# EAGLE schematic rl_energy_board (EAGLE 9.6.2)

## Sheet 1 of 4
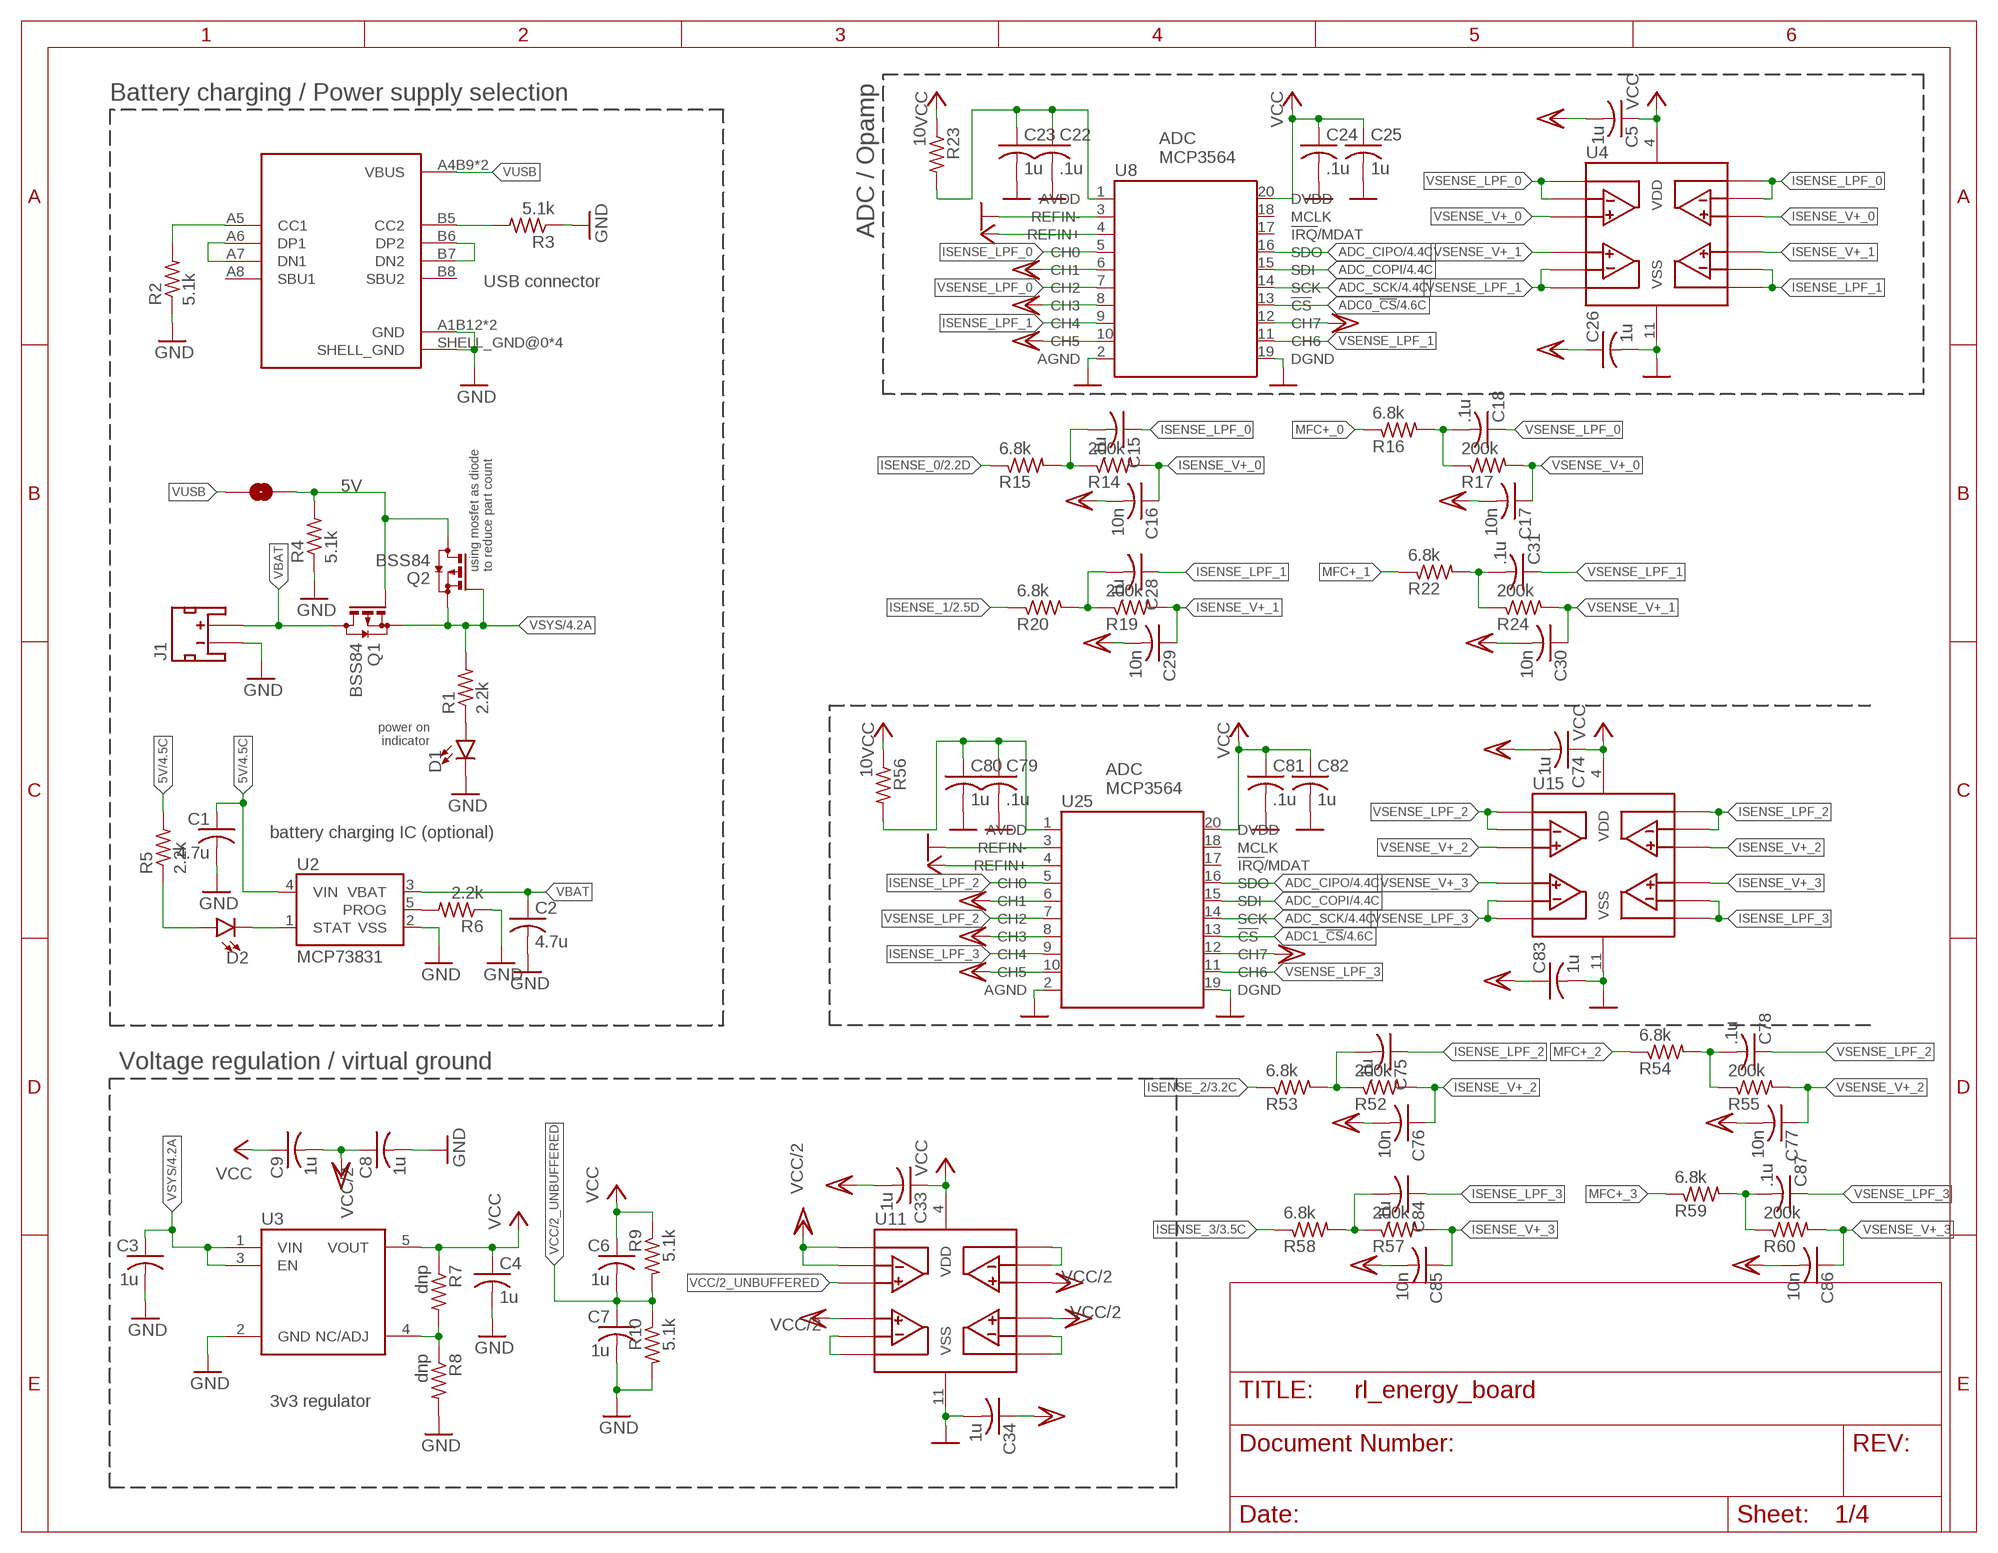
[diagram p0: schematic, sheet 1]

### Parts
C1  4.7u  C-USC0603  [C0603]
C2  4.7u  C-USC0603  [C0603]
C3  1u  C-USC0402  [C0402]
C4  1u  C-USC0402  [C0402]
C5  1u  C-USC0402  [C0402]
C6  1u  C-USC0402  [C0402]
C7  1u  C-USC0402  [C0402]
C8  1u  C-USC0402  [C0402]
C9  1u  C-USC0402  [C0402]
C15  .1u  C-USC0402  [C0402]
C16  10n  C-USC0402  [C0402]
C17  10n  C-USC0402  [C0402]
C18  .1u  C-USC0402  [C0402]
C22  .1u  C-USC0402  [C0402]
C23  1u  C-USC0402  [C0402]
C24  .1u  C-USC0402  [C0402]
C25  1u  C-USC0402  [C0402]
C26  1u  C-USC0402  [C0402]
C28  .1u  C-USC0402  [C0402]
C29  10n  C-USC0402  [C0402]
C30  10n  C-USC0402  [C0402]
C31  .1u  C-USC0402  [C0402]
C33  1u  C-USC0402  [C0402]
C34  1u  C-USC0402  [C0402]
C74  1u  C-USC0402  [C0402]
C75  .1u  C-USC0402  [C0402]
C76  10n  C-USC0402  [C0402]
C77  10n  C-USC0402  [C0402]
C78  .1u  C-USC0402  [C0402]
C79  .1u  C-USC0402  [C0402]
C80  1u  C-USC0402  [C0402]
C81  .1u  C-USC0402  [C0402]
C82  1u  C-USC0402  [C0402]
C83  1u  C-USC0402  [C0402]
C84  .1u  C-USC0402  [C0402]
C85  10n  C-USC0402  [C0402]
C86  10n  C-USC0402  [C0402]
C87  .1u  C-USC0402  [C0402]
D1  LED0603  [LED-0603]
D2  LED0603  [LED-0603]
J1  JST_2MM_MALE  [JST-2-SMD]
J2  USB4105  [USB4105]
JP1  JUMPER-SMT_2_NO_NO-SILK  [SMT-JUMPER_2_NO_NO-SILK]
Q1  BSS84  [SOT23]
Q2  BSS84  [SOT23]
R1  2.2k  R-US_R0402  [R0402]
R2  5.1k  R-US_R0402  [R0402]
R3  5.1k  R-US_R0402  [R0402]
R4  5.1k  R-US_R0402  [R0402]
R5  2.2k  R-US_R0402  [R0402]
R6  2.2k  R-US_R0402  [R0402]
R7  dnp  R-US_R0402  [R0402]
R8  dnp  R-US_R0402  [R0402]
R9  5.1k  R-US_R0402  [R0402]
R10  5.1k  R-US_R0402  [R0402]
R14  200k  R-US_R0402  [R0402]
R15  6.8k  R-US_R0402  [R0402]
R16  6.8k  R-US_R0402  [R0402]
R17  200k  R-US_R0402  [R0402]
R19  200k  R-US_R0402  [R0402]
R20  6.8k  R-US_R0402  [R0402]
R22  6.8k  R-US_R0402  [R0402]
R23  10  R-US_R0402  [R0402]
R24  200k  R-US_R0402  [R0402]
R52  200k  R-US_R0402  [R0402]
R53  6.8k  R-US_R0402  [R0402]
R54  6.8k  R-US_R0402  [R0402]
R55  200k  R-US_R0402  [R0402]
R56  10  R-US_R0402  [R0402]
R57  200k  R-US_R0402  [R0402]
R58  6.8k  R-US_R0402  [R0402]
R59  6.8k  R-US_R0402  [R0402]
R60  200k  R-US_R0402  [R0402]
U2  MCP73831  [SOT23-5]
U3  AP7366  [SOT95P285X130-5N]
U4  MCP6074  [SOP65P640X120-14N]
U8  MCP3564  [SOP65P640X120-20N]
U11  MCP6074  [SOP65P640X120-14N]
U15  MCP6074  [SOP65P640X120-14N]
U25  MCP3564  [SOP65P640X120-20N]

### Nets
5V: C1.1 JP1.1 Q1.1(G) Q2.3(D) R4.2 R5.2 U2.4(VIN) ; also sheet 4
ADC0_!CS!: U8.13(!CS) ; also sheet 4
ADC1_!CS!: U25.13(!CS) ; also sheet 4
ADC_CIPO: U8.16(SDO) U25.16(SDO) ; also sheet 4
ADC_COPI: U8.15(SDI) U25.15(SDI) ; also sheet 4
ADC_SCK: U8.14(SCK) U25.14(SCK) ; also sheet 4
GND: C1.2 C2.2 C3.2 C4.2 C7.2 C8.2 C22.2 C23.2 C24.2 C25.2 C26.2 C34.2 C79.2 C80.2 C81.2 C82.2 C83.2 D1.C J1.1(-) J2.A1B12(GND) J2.B1A12(GND) J2.SHELL_GND@0(SHELL_GND) J2.SHELL_GND@1(SHELL_GND) J2.SHELL_GND@2(SHELL_GND) J2.SHELL_GND@3(SHELL_GND) R2.1 R3.1 R4.1 R6.1 R8.2 R10.2 U2.2(VSS) U3.2(GND) U4.11(VSS) U8.2(AGND) U8.3(REFIN-) U8.19(DGND) U11.11(VSS) U15.11(VSS) U25.2(AGND) U25.3(REFIN-) U25.19(DGND) ; also sheet 2,3,4
ISENSE_0: R15.1 ; also sheet 2
ISENSE_1: R20.1 ; also sheet 2
ISENSE_2: R53.1 ; also sheet 3
ISENSE_3: R58.1 ; also sheet 3
ISENSE_LPF_0: C15.1 U4.13 U4.14 U8.5(CH0)
ISENSE_LPF_1: C28.1 U4.8 U4.9 U8.9(CH4)
ISENSE_LPF_2: C75.1 U15.13 U15.14 U25.5(CH0)
ISENSE_LPF_3: C84.1 U15.8 U15.9 U25.9(CH4)
ISENSE_V+_0: C16.1 R14.2 U4.12
ISENSE_V+_1: C29.1 R19.2 U4.10
ISENSE_V+_2: C76.1 R52.2 U15.12
ISENSE_V+_3: C85.1 R57.2 U15.10
MFC+_0: R16.1 ; also sheet 2
MFC+_1: R22.1 ; also sheet 2
MFC+_2: R54.1 ; also sheet 3
MFC+_3: R59.1 ; also sheet 3
N$1: D1.A R1.1
N$2: D2.C U2.1(STAT)
N$3: R6.2 U2.5(PROG)
N$4: J2.B6(DP2) J2.B7(DN2)
N$5: J2.A6(DP1) J2.A7(DN1)
N$6: J2.A5(CC1) R2.2
N$7: J2.B5(CC2) R3.2
N$8: D2.A R5.1
N$10: R7.2 R8.1 U3.4(NC/ADJ)
N$11: C28.2 R19.1 R20.2
N$14: C22.1 C23.1 R23.2 U8.1(AVDD)
N$17: C15.2 R14.1 R15.2
N$18: C18.2 R16.2 R17.1
N$19: U11.6 U11.7
N$20: U11.8 U11.9
N$21: C31.2 R22.2 R24.1
N$22: U11.13 U11.14
N$35: C78.2 R54.2 R55.1
N$36: C75.2 R52.1 R53.2
N$37: C79.1 C80.1 R56.2 U25.1(AVDD)
N$38: C84.2 R57.1 R58.2
N$39: C87.2 R59.2 R60.1
VBAT: C2.1 J1.2(+) Q1.3(D) U2.3(VBAT)
VCC: C4.1 C5.1 C6.1 C9.1 C24.1 C25.1 C33.1 C74.1 C81.1 C82.1 R7.1 R9.1 R23.1 R56.1 U3.5(VOUT) U4.4(VDD) U8.4(REFIN+) U8.20(DVDD) U11.4(VDD) U15.4(VDD) U25.4(REFIN+) U25.20(DVDD) ; also sheet 2,3,4
VCC/2: C5.2 C8.1 C9.2 C16.2 C17.2 C26.1 C29.2 C30.2 C33.2 C34.1 C74.2 C76.2 C77.2 C83.1 C85.2 C86.2 U8.6(CH1) U8.8(CH3) U8.10(CH5) U8.12(CH7) U11.1 U11.2 U11.5 U11.10 U11.12 U25.6(CH1) U25.8(CH3) U25.10(CH5) U25.12(CH7) ; also sheet 2,3
VCC/2_UNBUFFERED: C6.2 C7.1 R9.2 R10.1 U11.3
VSENSE_LPF_0: C18.1 U4.1 U4.2 U8.7(CH2)
VSENSE_LPF_1: C31.1 U4.6 U4.7 U8.11(CH6)
VSENSE_LPF_2: C78.1 U15.1 U15.2 U25.7(CH2)
VSENSE_LPF_3: C87.1 U15.6 U15.7 U25.11(CH6)
VSENSE_V+_0: C17.1 R17.2 U4.3
VSENSE_V+_1: C30.1 R24.2 U4.5
VSENSE_V+_2: C77.1 R55.2 U15.3
VSENSE_V+_3: C86.1 R60.2 U15.5
VSYS: C3.1 Q1.2(S) Q2.1(G) Q2.2(S) R1.2 U3.1(VIN) U3.3(EN) ; also sheet 4
VUSB: J2.A4B9(VBUS) J2.B4A9(VBUS) JP1.2
Unconnected: J1.NC1(PAD1) J1.NC2(PAD2) J2.A8(SBU1) J2.B8(SBU2) U8.17(!IRQ!/MDAT) U8.18(MCLK) U25.17(!IRQ!/MDAT) U25.18(MCLK)

### Notes on the sheet
- ADC / Opamp
- Battery charging / Power supply selection
- ADC
  MCP3564
- USB connector
- using mosfet as diode
  to reduce part count
- power on
  indicator
- ADC
  MCP3564
- battery charging IC (optional)
- Voltage regulation / virtual ground
- 3v3 regulator

## Sheet 2 of 4
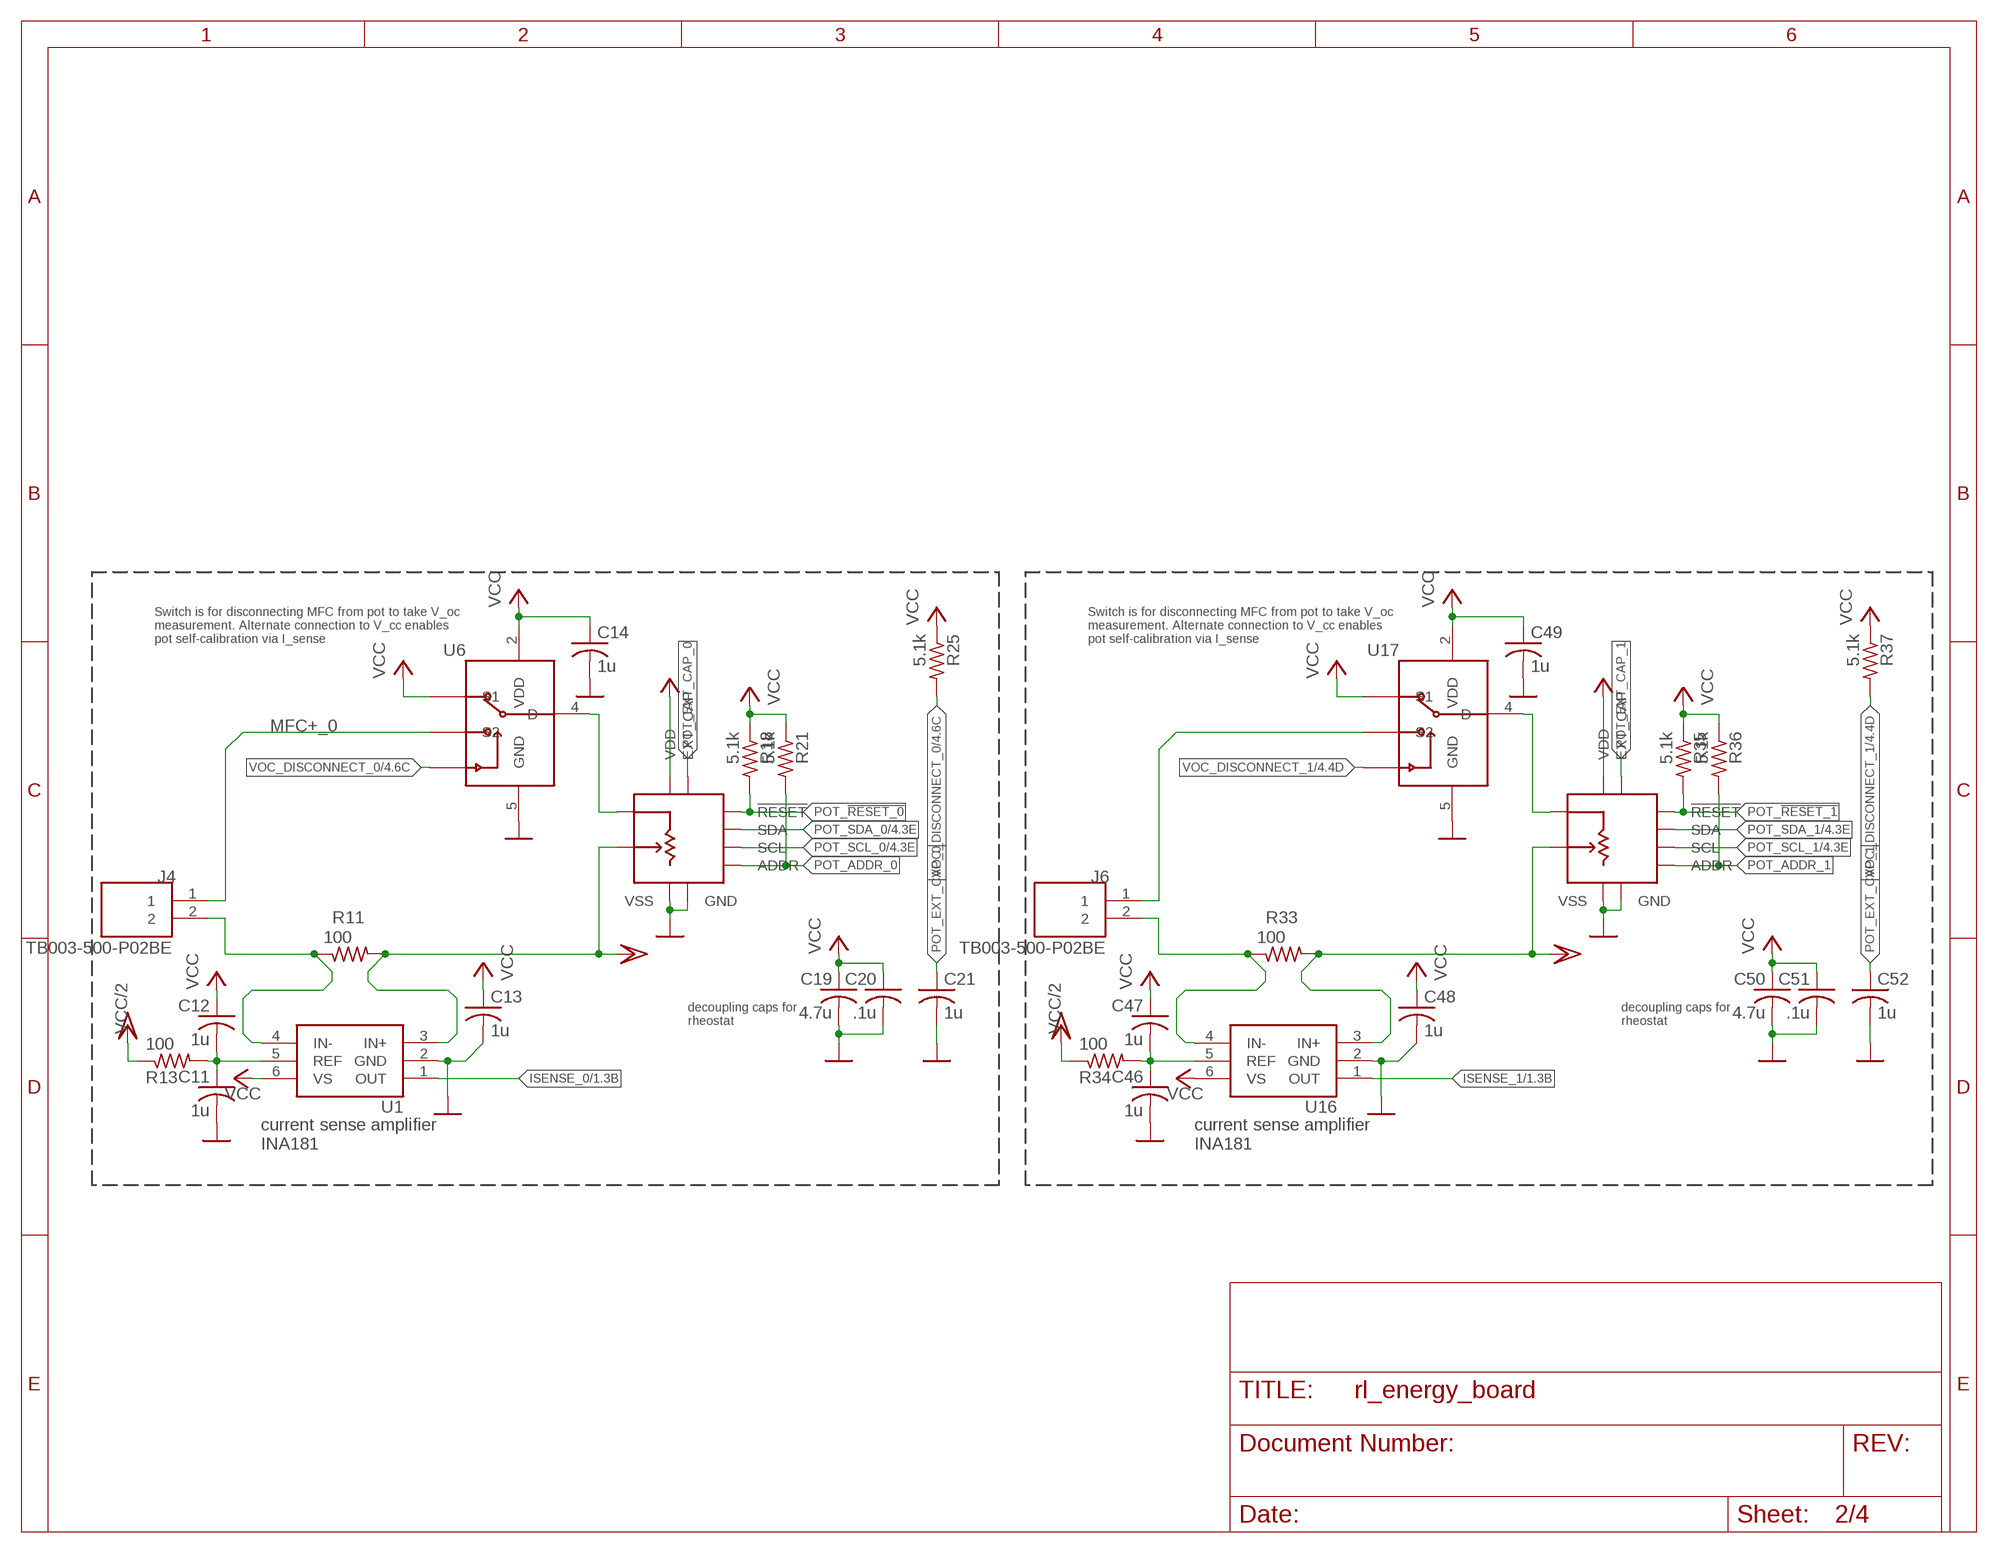
[diagram p1: schematic, sheet 2]

### Parts
C11  1u  C-USC0402  [C0402]
C12  1u  C-USC0402  [C0402]
C13  1u  C-USC0402  [C0402]
C14  1u  C-USC0402  [C0402]
C19  4.7u  C-USC0603  [C0603]
C20  .1u  C-USC0402  [C0402]
C21  1u  C-USC0402  [C0402]
C46  1u  C-USC0402  [C0402]
C47  1u  C-USC0402  [C0402]
C48  1u  C-USC0402  [C0402]
C49  1u  C-USC0402  [C0402]
C50  4.7u  C-USC0603  [C0603]
C51  .1u  C-USC0402  [C0402]
C52  1u  C-USC0402  [C0402]
J4  TB003-500-P02BE  [CUI_TB003-500-P02BE]
J6  TB003-500-P02BE  [CUI_TB003-500-P02BE]
R11  100  R-US_R0603  [R0603]
R13  100  R-US_R0402  [R0402]
R18  5.1k  R-US_R0402  [R0402]
R21  5.1k  R-US_R0402  [R0402]
R25  5.1k  R-US_R0402  [R0402]
R33  100  R-US_R0603  [R0603]
R34  100  R-US_R0402  [R0402]
R35  5.1k  R-US_R0402  [R0402]
R36  5.1k  R-US_R0402  [R0402]
R37  5.1k  R-US_R0402  [R0402]
U1  INA181  [SOT95P280X145-6N]
U6  TMUX1247  [SOT65P210X110-6N]
U7  AD5272BRMZ-XXX  [SOP50P490X95-10N]
U16  INA181  [SOT95P280X145-6N]
U17  TMUX1247  [SOT65P210X110-6N]
U18  AD5272BRMZ-XXX  [SOP50P490X95-10N]

### Nets
GND: C11.2 C13.2 C14.2 C19.2 C20.2 C21.2 C46.2 C48.2 C49.2 C50.2 C51.2 C52.2 U1.2(GND) U6.5(GND) U7.4(VSS) U7.6(GND) U16.2(GND) U17.5(GND) U18.4(VSS) U18.6(GND) ; also sheet 1,3,4
ISENSE_0: U1.1(OUT) ; also sheet 1
ISENSE_1: U16.1(OUT) ; also sheet 1
MFC+_0: J4.1 U6.1(S2) ; also sheet 1
MFC+_1: J6.1 U17.1(S2) ; also sheet 1
MFC-: J4.2 R11.1 U1.4(IN-)
MFC-_1: J6.2 R33.1 U16.4(IN-)
N$12: C11.1 C12.2 R13.2 U1.5(REF)
N$13: U6.4(D) U7.2(A)
N$26: C46.1 C47.2 R34.2 U16.5(REF)
N$27: U17.4(D) U18.2(A)
POT_!RESET_0: R18.2 U7.7(!RESET)
POT_!RESET_1: R35.2 U18.7(!RESET)
POT_ADDR_0: R21.2 U7.10(ADDR)
POT_ADDR_1: R36.2 U18.10(ADDR)
POT_EXT_CAP_0: C21.1 U7.5(EXT_CAP)
POT_EXT_CAP_1: C52.1 U18.5(EXT_CAP)
POT_SCL_0: U7.9(SCL) ; also sheet 4
POT_SCL_1: U18.9(SCL) ; also sheet 4
POT_SDA_0: U7.8(SDA) ; also sheet 4
POT_SDA_1: U18.8(SDA) ; also sheet 4
VCC: C12.1 C13.1 C14.1 C19.1 C20.1 C47.1 C48.1 C49.1 C50.1 C51.1 R18.1 R21.1 R25.1 R35.1 R36.1 R37.1 U1.6(VS) U6.2(VDD) U6.3(S1) U7.1(VDD) U16.6(VS) U17.2(VDD) U17.3(S1) U18.1(VDD) ; also sheet 1,3,4
VCC/2: R11.2 R13.1 R33.2 R34.1 U1.3(IN+) U7.3(W) U16.3(IN+) U18.3(W) ; also sheet 1,3
VOC_DISCONNECT_0: R25.2 U6.6(SEL) ; also sheet 4
VOC_DISCONNECT_1: R37.2 U17.6(SEL) ; also sheet 4

### Notes on the sheet
- Switch is for disconnecting MFC from pot to take V_oc
  measurement. Alternate connection to V_cc enables 
  pot self-calibration via I_sense
- Switch is for disconnecting MFC from pot to take V_oc
  measurement. Alternate connection to V_cc enables 
  pot self-calibration via I_sense
- decoupling caps for 
  rheostat
- decoupling caps for 
  rheostat
- current sense amplifier
  INA181
- current sense amplifier
  INA181

## Sheet 3 of 4
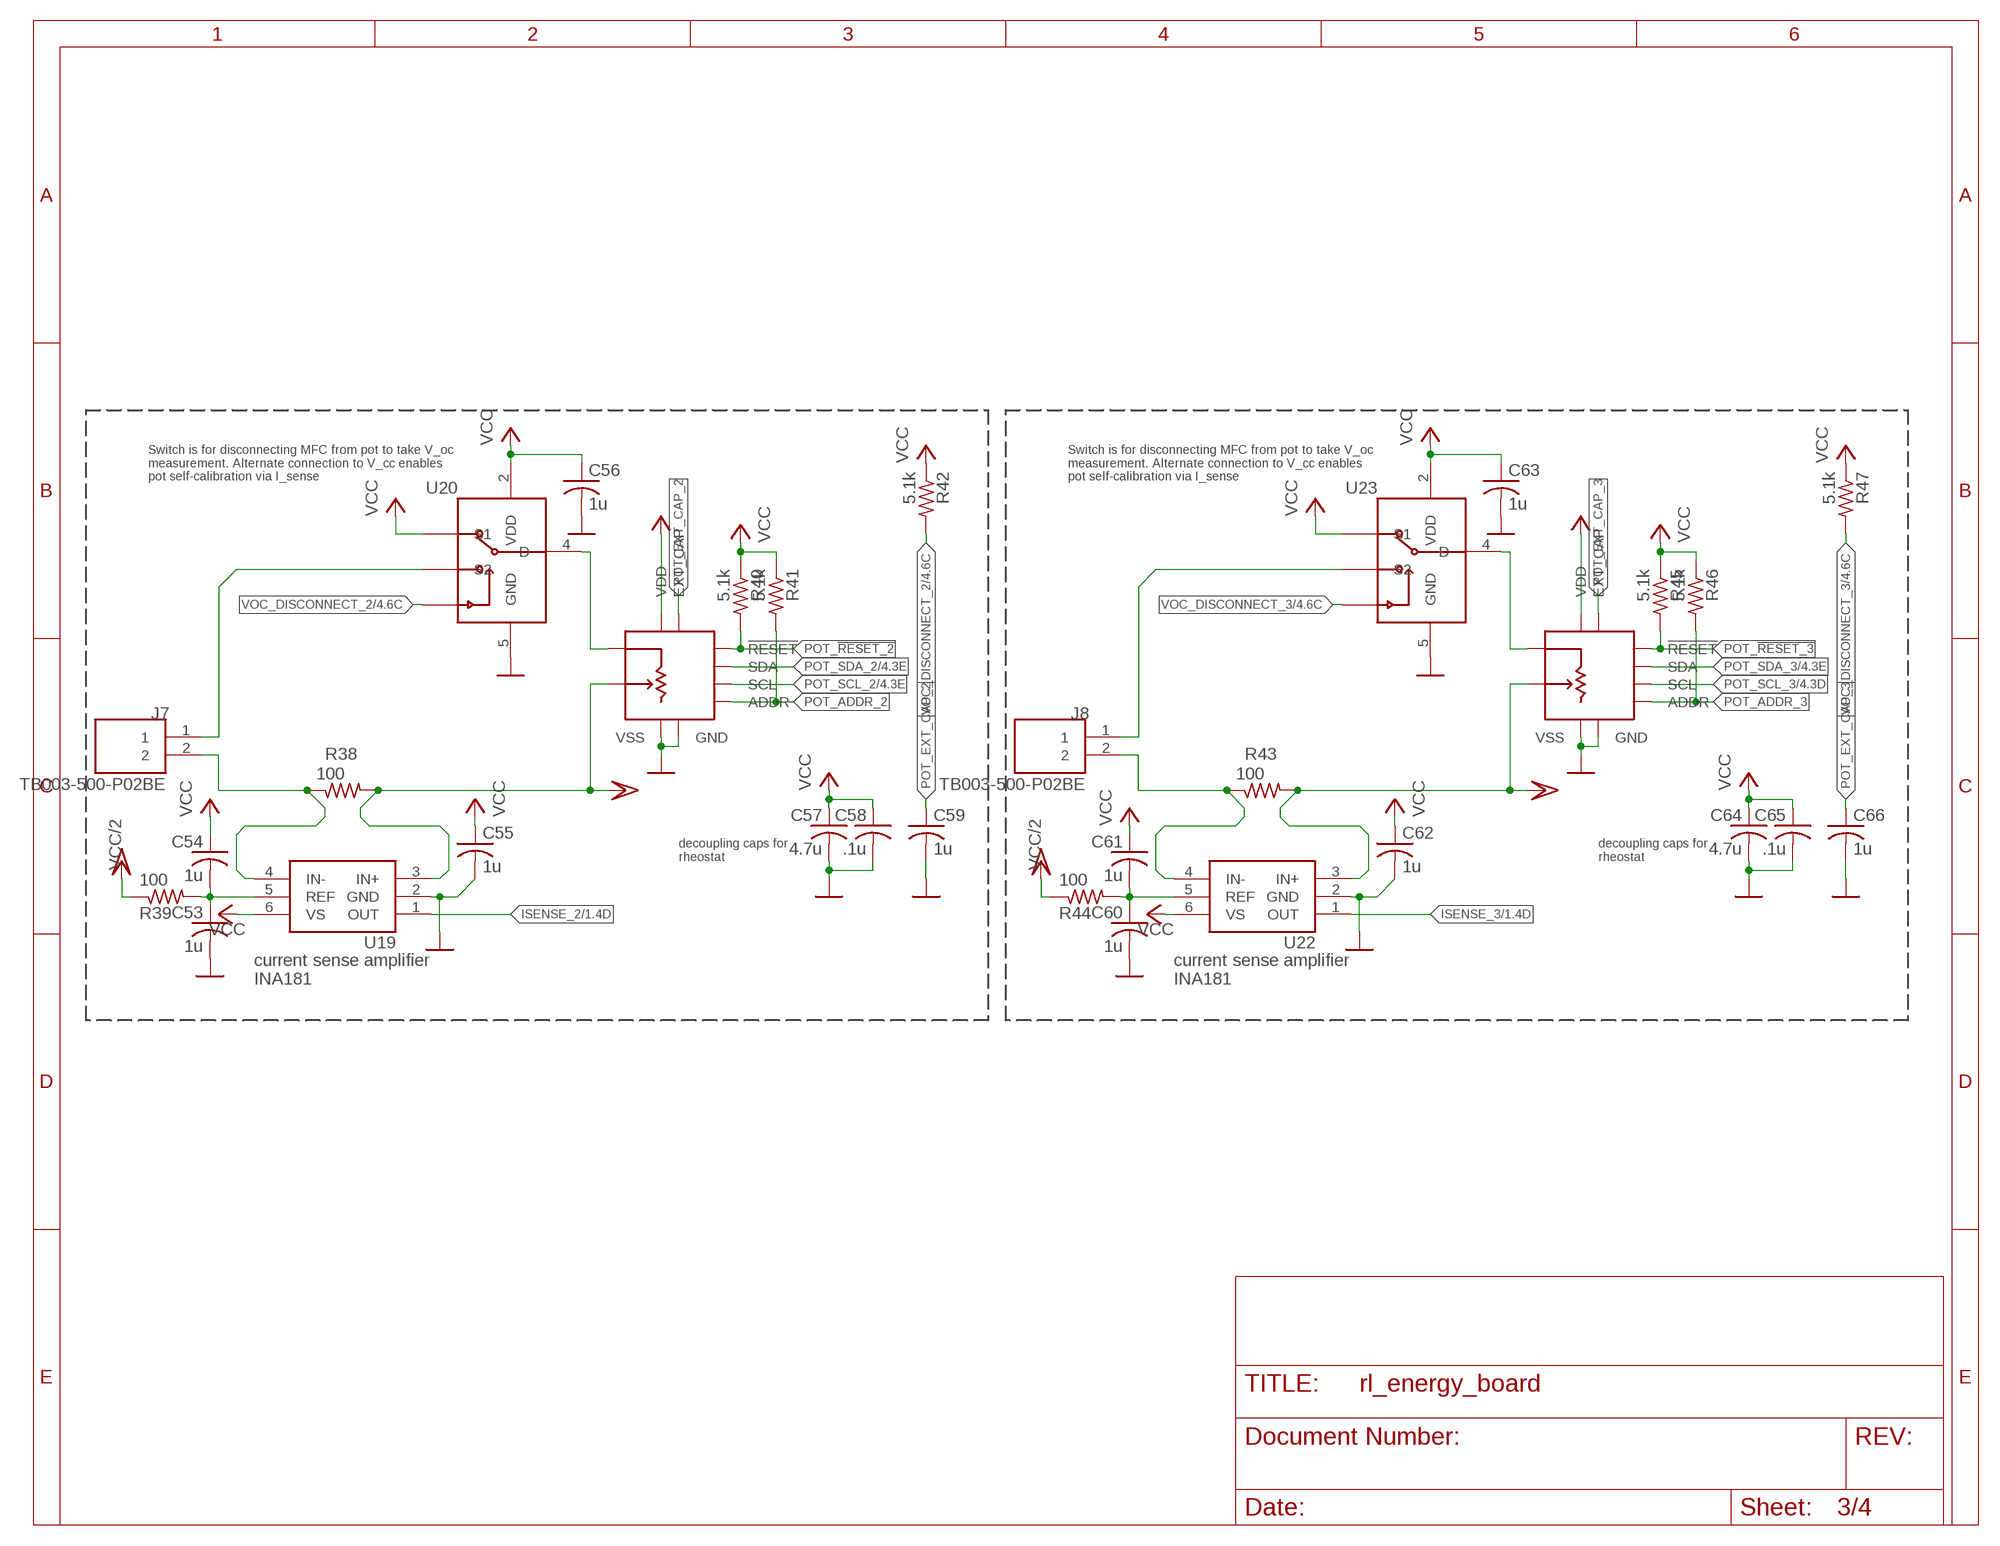
[diagram p2: schematic, sheet 3]

### Parts
C53  1u  C-USC0402  [C0402]
C54  1u  C-USC0402  [C0402]
C55  1u  C-USC0402  [C0402]
C56  1u  C-USC0402  [C0402]
C57  4.7u  C-USC0603  [C0603]
C58  .1u  C-USC0402  [C0402]
C59  1u  C-USC0402  [C0402]
C60  1u  C-USC0402  [C0402]
C61  1u  C-USC0402  [C0402]
C62  1u  C-USC0402  [C0402]
C63  1u  C-USC0402  [C0402]
C64  4.7u  C-USC0603  [C0603]
C65  .1u  C-USC0402  [C0402]
C66  1u  C-USC0402  [C0402]
J7  TB003-500-P02BE  [CUI_TB003-500-P02BE]
J8  TB003-500-P02BE  [CUI_TB003-500-P02BE]
R38  100  R-US_R0603  [R0603]
R39  100  R-US_R0402  [R0402]
R40  5.1k  R-US_R0402  [R0402]
R41  5.1k  R-US_R0402  [R0402]
R42  5.1k  R-US_R0402  [R0402]
R43  100  R-US_R0603  [R0603]
R44  100  R-US_R0402  [R0402]
R45  5.1k  R-US_R0402  [R0402]
R46  5.1k  R-US_R0402  [R0402]
R47  5.1k  R-US_R0402  [R0402]
U19  INA181  [SOT95P280X145-6N]
U20  TMUX1247  [SOT65P210X110-6N]
U21  AD5272BRMZ-XXX  [SOP50P490X95-10N]
U22  INA181  [SOT95P280X145-6N]
U23  TMUX1247  [SOT65P210X110-6N]
U24  AD5272BRMZ-XXX  [SOP50P490X95-10N]

### Nets
GND: C53.2 C55.2 C56.2 C57.2 C58.2 C59.2 C60.2 C62.2 C63.2 C64.2 C65.2 C66.2 U19.2(GND) U20.5(GND) U21.4(VSS) U21.6(GND) U22.2(GND) U23.5(GND) U24.4(VSS) U24.6(GND) ; also sheet 1,2,4
ISENSE_2: U19.1(OUT) ; also sheet 1
ISENSE_3: U22.1(OUT) ; also sheet 1
MFC+_2: J7.1 U20.1(S2) ; also sheet 1
MFC+_3: J8.1 U23.1(S2) ; also sheet 1
MFC-_2: J7.2 R38.1 U19.4(IN-)
MFC-_3: J8.2 R43.1 U22.4(IN-)
N$28: C53.1 C54.2 R39.2 U19.5(REF)
N$29: U20.4(D) U21.2(A)
N$30: C60.1 C61.2 R44.2 U22.5(REF)
N$31: U23.4(D) U24.2(A)
POT_!RESET_2: R40.2 U21.7(!RESET)
POT_!RESET_3: R45.2 U24.7(!RESET)
POT_ADDR_2: R41.2 U21.10(ADDR)
POT_ADDR_3: R46.2 U24.10(ADDR)
POT_EXT_CAP_2: C59.1 U21.5(EXT_CAP)
POT_EXT_CAP_3: C66.1 U24.5(EXT_CAP)
POT_SCL_2: U21.9(SCL) ; also sheet 4
POT_SCL_3: U24.9(SCL) ; also sheet 4
POT_SDA_2: U21.8(SDA) ; also sheet 4
POT_SDA_3: U24.8(SDA) ; also sheet 4
VCC: C54.1 C55.1 C56.1 C57.1 C58.1 C61.1 C62.1 C63.1 C64.1 C65.1 R40.1 R41.1 R42.1 R45.1 R46.1 R47.1 U19.6(VS) U20.2(VDD) U20.3(S1) U21.1(VDD) U22.6(VS) U23.2(VDD) U23.3(S1) U24.1(VDD) ; also sheet 1,2,4
VCC/2: R38.2 R39.1 R43.2 R44.1 U19.3(IN+) U21.3(W) U22.3(IN+) U24.3(W) ; also sheet 1,2
VOC_DISCONNECT_2: R42.2 U20.6(SEL) ; also sheet 4
VOC_DISCONNECT_3: R47.2 U23.6(SEL) ; also sheet 4

### Notes on the sheet
- Switch is for disconnecting MFC from pot to take V_oc
  measurement. Alternate connection to V_cc enables 
  pot self-calibration via I_sense
- Switch is for disconnecting MFC from pot to take V_oc
  measurement. Alternate connection to V_cc enables 
  pot self-calibration via I_sense
- decoupling caps for 
  rheostat
- decoupling caps for 
  rheostat
- current sense amplifier
  INA181
- current sense amplifier
  INA181

## Sheet 4 of 4
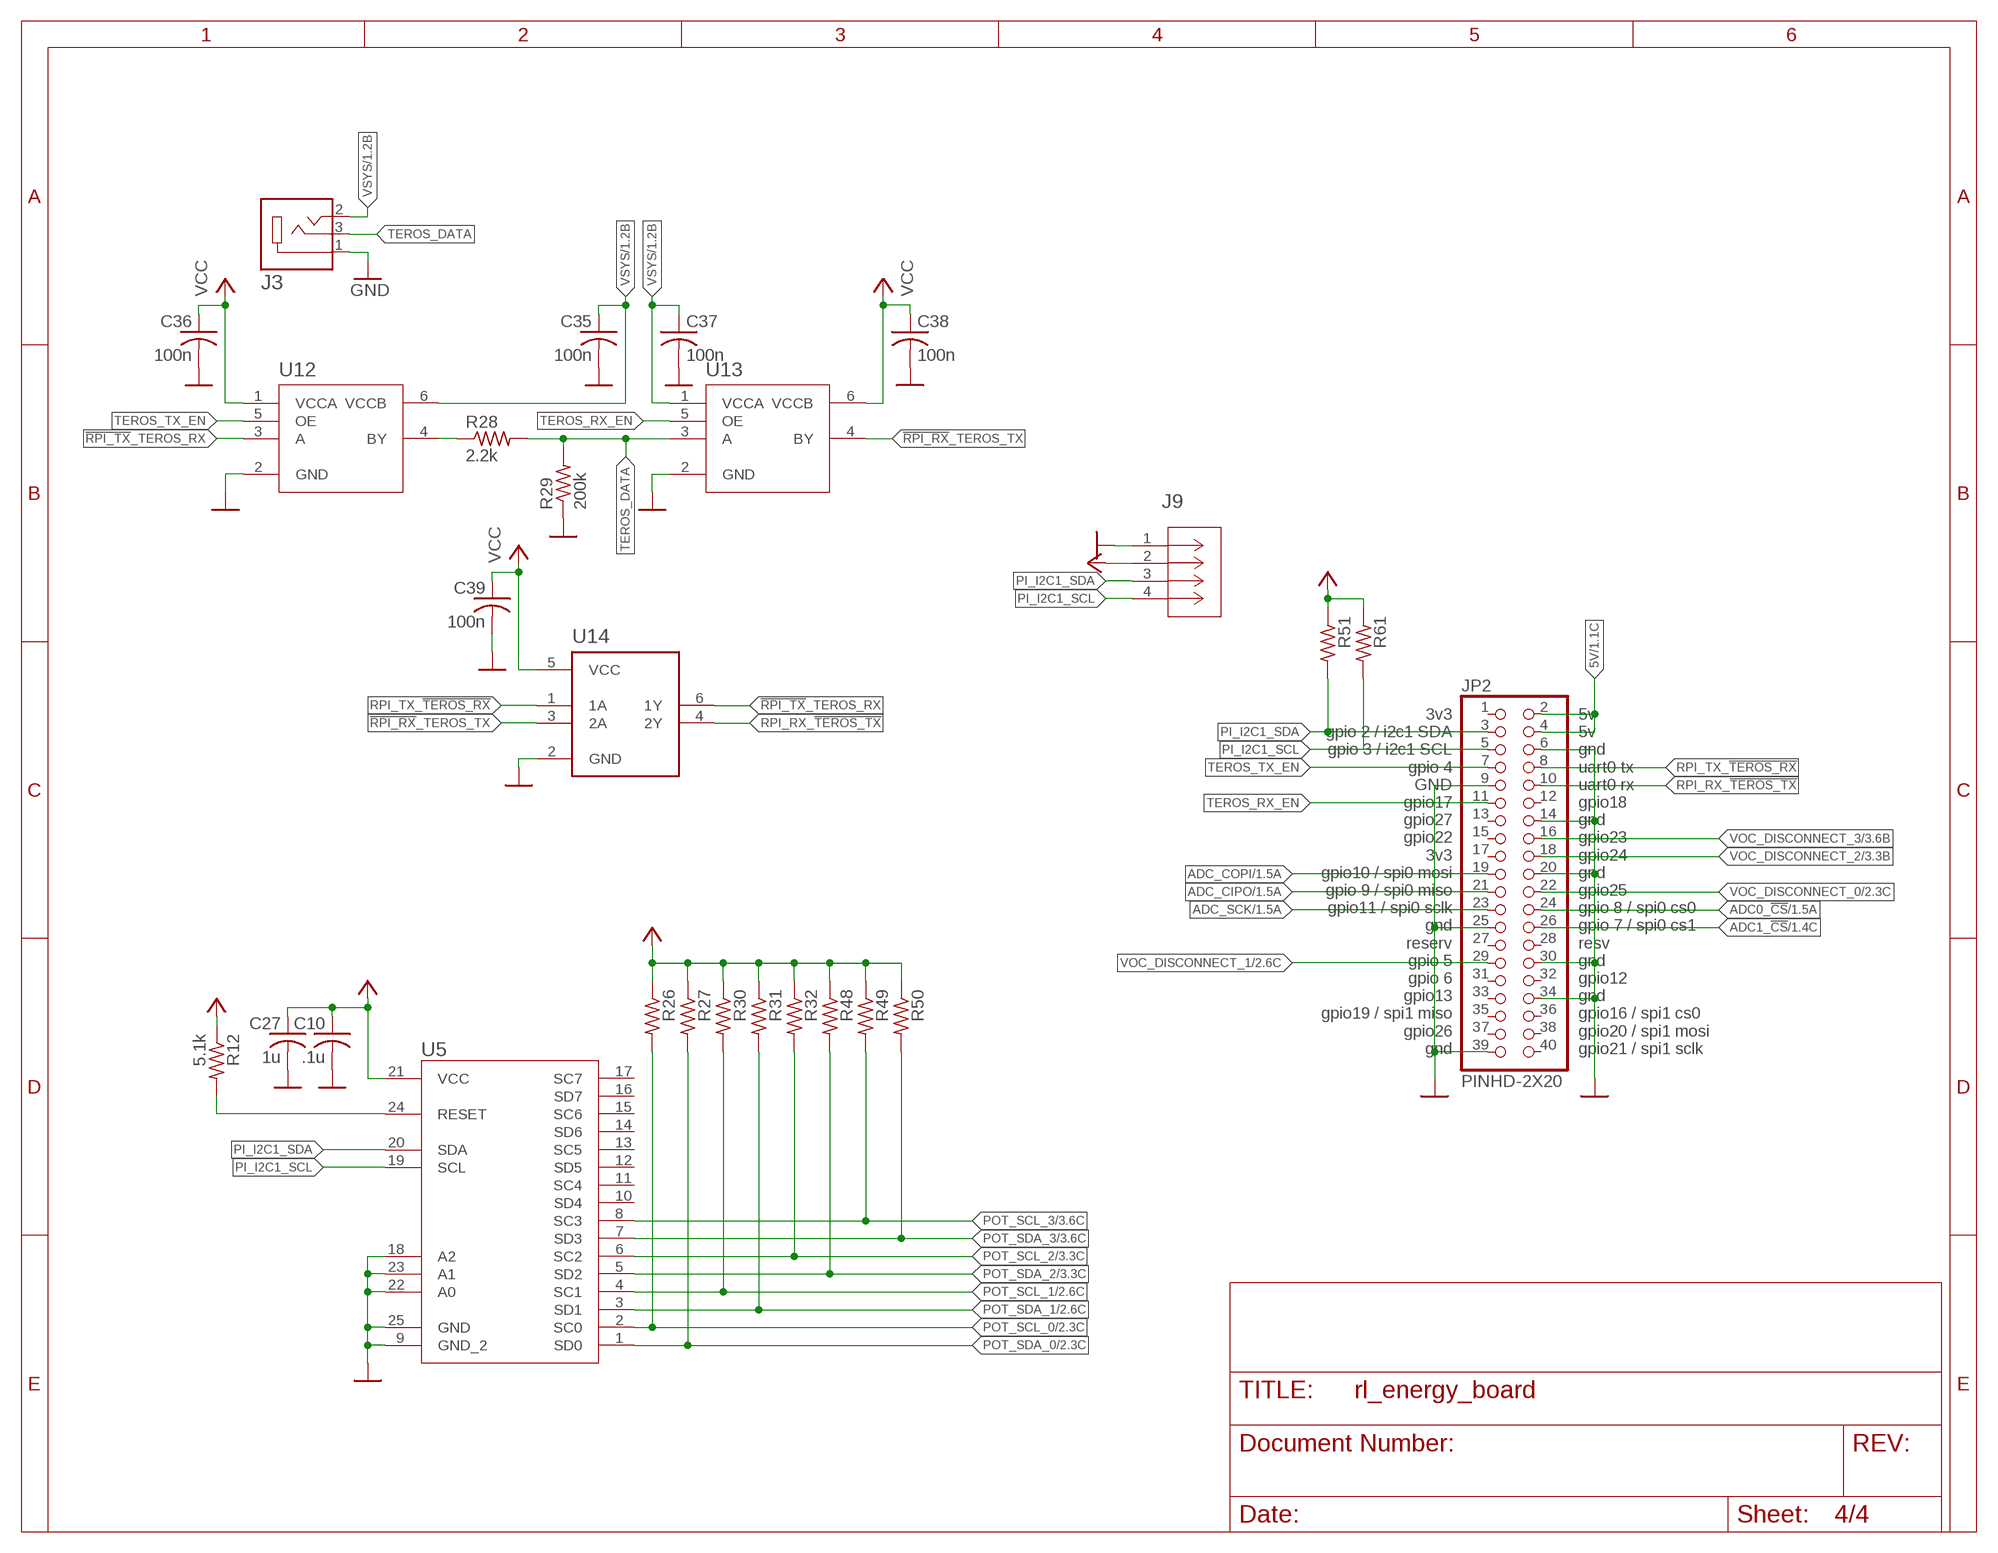
[diagram p3: schematic, sheet 4]

### Parts
C10  .1u  C-USC0402  [C0402]
C27  1u  C-USC0402  [C0402]
C35  100n  C-USC0402  [C0402]
C36  100n  C-USC0402  [C0402]
C37  100n  C-USC0402  [C0402]
C38  100n  C-USC0402  [C0402]
C39  100n  C-USC0402  [C0402]
J3  SJ-3523-SMT-TR  [CUI_SJ-3523-SMT-TR]
J9  SM04B-SRSS-TB  [CONN_SM04B-SRSS-TB_JST]
JP2  PINHD-2X20  [2X20]
R12  5.1k  R-US_R0402  [R0402]
R26  5.1k  R-US_R0402  [R0402]
R27  5.1k  R-US_R0402  [R0402]
R28  2.2k  R-US_R0402  [R0402]
R29  200k  R-US_R0402  [R0402]
R30  5.1k  R-US_R0402  [R0402]
R31  5.1k  R-US_R0402  [R0402]
R32  5.1k  R-US_R0402  [R0402]
R48  5.1k  R-US_R0402  [R0402]
R49  5.1k  R-US_R0402  [R0402]
R50  5.1k  R-US_R0402  [R0402]
R51  5.1k  R-US_R0402  [R0402]
R61  5.1k  R-US_R0402  [R0402]
U5  TCA9548ARGERQ1  [QFN_GERQ1_TEX]
U12  TXU0101QDCKRQ1  [SOT_101QDCKRQ1_TEX]
U13  TXU0101QDCKRQ1  [SOT_101QDCKRQ1_TEX]
U14  SN74LVC2G14DCKR  [SOT65P210X110-6N]

### Nets
5V: JP2.2 JP2.4 ; also sheet 1
!RPI_RX!_TEROS_TX: U13.4(BY) U14.3(2A)
!RPI_TX!_TEROS_RX: U12.3(A) U14.6(1Y)
ADC0_!CS!: JP2.24 ; also sheet 1
ADC1_!CS!: JP2.26 ; also sheet 1
ADC_CIPO: JP2.21 ; also sheet 1
ADC_COPI: JP2.19 ; also sheet 1
ADC_SCK: JP2.23 ; also sheet 1
GND: C10.2 C27.2 C35.2 C36.2 C37.2 C38.2 C39.2 J3.1 J9.1 JP2.6 JP2.9 JP2.14 JP2.20 JP2.25 JP2.30 JP2.34 JP2.39 R29.1 U5.9(GND_2) U5.18(A2) U5.22(A0) U5.23(A1) U5.25(GND) U12.2(GND) U13.2(GND) U14.2(GND) ; also sheet 1,2,3
N$9: R12.2 U5.24(RESET)
N$23: R28.1 U12.4(BY)
PI_I2C1_SCL: J9.4 JP2.5 R61.2 U5.19(SCL)
PI_I2C1_SDA: J9.3 JP2.3 R51.2 U5.20(SDA)
POT_SCL_0: R26.2 U5.2(SC0) ; also sheet 2
POT_SCL_1: R30.2 U5.4(SC1) ; also sheet 2
POT_SCL_2: R32.2 U5.6(SC2) ; also sheet 3
POT_SCL_3: R49.2 U5.8(SC3) ; also sheet 3
POT_SDA_0: R27.2 U5.1(SD0) ; also sheet 2
POT_SDA_1: R31.2 U5.3(SD1) ; also sheet 2
POT_SDA_2: R48.2 U5.5(SD2) ; also sheet 3
POT_SDA_3: R50.2 U5.7(SD3) ; also sheet 3
RPI_RX_!TEROS_TX!: JP2.10 U14.4(2Y)
RPI_TX_!TEROS_RX!: JP2.8 U14.1(1A)
TEROS_DATA: J3.3 R28.2 R29.2 U13.3(A)
TEROS_RX_EN: JP2.11 U13.5(OE)
TEROS_TX_EN: JP2.7 U12.5(OE)
VCC: C10.1 C27.1 C36.1 C38.1 C39.1 J9.2 R12.1 R26.1 R27.1 R30.1 R31.1 R32.1 R48.1 R49.1 R50.1 R51.1 R61.1 U5.21(VCC) U12.1(VCCA) U13.6(VCCB) U14.5(VCC) ; also sheet 1,2,3
VOC_DISCONNECT_0: JP2.22 ; also sheet 2
VOC_DISCONNECT_1: JP2.29 ; also sheet 2
VOC_DISCONNECT_2: JP2.18 ; also sheet 3
VOC_DISCONNECT_3: JP2.16 ; also sheet 3
VSYS: C35.1 C37.1 J3.2 U12.6(VCCB) U13.1(VCCA) ; also sheet 1
Unconnected: JP2.1 JP2.12 JP2.13 JP2.15 JP2.17 JP2.27 JP2.28 JP2.31 JP2.32 JP2.33 JP2.35 JP2.36 JP2.37 JP2.38 JP2.40 U5.10(SD4) U5.11(SC4) U5.12(SD5) U5.13(SC5) U5.14(SD6) U5.15(SC6) U5.16(SD7) U5.17(SC7)

### Notes on the sheet
- 3v3
  gpio 2 / i2c1 SDA
  gpio 3 / i2c1 SCL
  gpio 4
  GND
  gpio17
  gpio27
  gpio22
  3v3
  gpio10 / spi0 mosi
  gpio 9 / spi0 miso
  gpio11 / spi0 sclk
  gnd
  reserv
  gpio 5
  gpio 6
  gpio13
  gpio19 / spi1 miso
  gpio26
  gnd
- 5v
  5v
  gnd
  uart0 tx
  uart0 rx
  gpio18
  gnd
  gpio23
  gpio24
  gnd
  gpio25
  gpio 8 / spi0 cs0
  gpio 7 / spi0 cs1
  resv
  gnd
  gpio12
  gnd
  gpio16 / spi1 cs0
  gpio20 / spi1 mosi
  gpio21 / spi1 sclk

## Library data of the parts
C1 C2 C19 C50 C57 C64 = rcl:C-US: CAPACITOR, American symbol; MFR: Samsung Electro-Mechanics; MFR_PN: CL10A475KP8NNNC; SPICEPREFIX: C
C3-C9 C11-C14 C21 C23 C25-C27 C33 C34 C46-C49 C52-C56 C59-C63 C66 C74 C80 C82 C83 = rcl:C-US: CAPACITOR, American symbol; MFR: Samsung Electro-Mechanics; MFR_PN: CL10B105KP8NNNC; SPICEPREFIX: C
C10 C15 C18 C20 C22 C24 C28 C31 C51 C58 C65 C75 C78 C79 C81 C84 C87 = rcl:C-US: CAPACITOR, American symbol; MFR: Samsung Electro-Mechanics; MFR_PN: CL10B104KB8NNNC; SPICEPREFIX: C
C16 C17 C29 C30 C76 C77 C85 C86 = rcl:C-US: CAPACITOR, American symbol; MFR: Samsung Electro-Mechanics; MFR_PN: CL10B103KB8NNNC; SPICEPREFIX: C
C35-C39 = rcl:C-US: CAPACITOR, American symbol; SPICEPREFIX: C
D1 D2 = SparkFun-LED:LED: LED (Generic) Standard schematic elements and footprints for 5mm, 3mm, 1206, and 0603 sized LEDs. Generic LEDs with no color specified.; MFR: Lite-On Incorporated; MFR_PN: LTST-C191KRKT
J1 = SparkFun-Connectors:JST_2MM_MALE: JST 2MM MALE RA CONNECTOR Two pin, compact surface mount connector. Commonly used as a battery input connection point. We really like the solid locking feeling and high current rating on these small connectors. We use these all the time as battery connectors. Mates to single-cell LiPo batteries. Here is the connector we sell at SparkFun: JST Right Angle Connector - White <https://www.sparkfun.com/products/8612> (PRT-08612) Datasheet <http://www.sparkfun.com/datasheets/Prototyping/Connectors/JST-Horizontal.pdf> It was used on these SparkFun products: SparkFun MOSFET Power Controller <https://www.sparkfun.com/products/11214> (PRT-11214) SparkFun Battery Babysitter - LiPo Battery Manager <https://www.sparkfun.com/products/13777> (PRT-13777) And many, many others that required a lipo battery connection.; MFR: JST; MFR_PN: S2B-PH-SM4-TB(LF)(SN); PROD_ID: CONN-11443; SF_ID: PRT-08612
J2 = usb4105:USB4105; MFR: GCT; MFR_PN: USB4105-GF-A
J3 = SJ-3523-SMT-TR:SJ-3523-SMT-TR: Audio Jack Connector 3.5 mm Low Profile Surface Mount Stereo Jack, 3 Pin Right-Angle; MF: CUI Inc; STANDARD: Manufacturer recommendations
J4 J6-J8 = TB003-500-P02BE:TB003-500-P02BE; MANUFACTURER: CUI; STANDARD: Manufacturer Recommendations
J9 = SM04B-SRSS-TB:SM04B-SRSS-TB; COPYRIGHT: Copyright (C) 2024 Ultra Librarian. All rights reserved.; MANUFACTURER_PART_NUMBER: SM04B-SRSS-TB; MFR_NAME: JST
JP1 = SparkFun-Jumpers:JUMPER-SMT_2_NO: Normally open jumper This jumper has two pads in close proximity to each other. Apply solder to close the connection. Round pads are easier to solder for beginners, but are a lot larger. SparkFun Product that uses the round pads: SparkFun EL Sequencer <https://www.sparkfun.com/products/12781>
JP2 = Connector:PINHD-2X20: PIN HEADER; CATEGORY: CONNECTOR; SUB-CATEGORY: PIN-HEADER
Q1 Q2 = transistor-small-signal:BSS84: P-CHANNEL MOS FET; MFR: Taiwan Semiconductor Corporation; MFR_PN: BSS84W RFG
R1 R5 R6 = resistor:R-US_: RESISTOR, American symbol; MFR: Yageo; MFR_PN: RC0603FR-072KL
R2-R4 R9 R10 = resistor:R-US_: RESISTOR, American symbol; MFR: Yageo; MFR_PN: RC0603FR-075K1L
R7 R8 = resistor:R-US_: RESISTOR, American symbol
R11 R23 R33 R38 R43 R56 = rcl:R-US_: RESISTOR, American symbol; MFR: Stackpole Electronics Incorporated; MFR_PN: RNCF0603BKE4R70; SPICEPREFIX: R
R12 R18 R21 R25-R27 R30-R32 R35-R37 R40-R42 R45-R51 R61 = rcl:R-US_: RESISTOR, American symbol; MFR: Yageo; MFR_PN: RC0603FR-075K1L; SPICEPREFIX: R
R13 R34 R39 R44 = rcl:R-US_: RESISTOR, American symbol; MFR: Yageo; MFR_PN: RT0603BRD07100RL; SPICEPREFIX: R
R14 R17 R19 R24 R52 R55 R57 R60 = rcl:R-US_: RESISTOR, American symbol; MFR: Yageo; MFR_PN: RC0603FR-07200KL; SPICEPREFIX: R
R15 R16 R20 R22 R53 R54 R58 R59 = rcl:R-US_: RESISTOR, American symbol; MFR: Yageo; MFR_PN: RC0603FR-076K8L; SPICEPREFIX: R
R28 R29 = rcl:R-US_: RESISTOR, American symbol; SPICEPREFIX: R
U1 U16 U19 U22 = ina181:INA181; MFR: Texas Instruments; MFR_PN: INA181A4IDBVT
U2 = SparkFun-IC-Power:MCP73831: MCP73831T Li-Ion, Li-Pol Controller Miniature single cell, fully integrated Li-Ion, Li-polymer charge management controller Datasheet <http://ww1.microchip.com/downloads/en/DeviceDoc/20001984g.pdf> SparkFun Products: SparkFun ESP32 Thing <https://www.sparkfun.com/products/13907> SparkFun 9DoF Razor IMU M0 <https://www.sparkfun.com/products/14001>; MFR: Microchip Technology; MFR_PN: MCP73831T-2DCI/OT; PROD_ID: IC-09995
U3 = ap7366:AP7366; MFR: Diodes Incorporated; MFR_PN: AP7366-33W5-7
U4 U11 U15 = mcp6074:MCP6074; MFR: Microchip Technology; MFR_PN: MCP6074T-E/ST
U5 = TCA9548:TCA9548ARGERQ1; COPYRIGHT: Copyright (C) 2024 Ultra Librarian. All rights reserved.; MANUFACTURER_PART_NUMBER: TCA9548ARGERQ1; MFR_NAME: Texas Instruments
U6 U17 U20 U23 = tmux1247:TMUX1247: Analog SPDT switch IC 3 ohm on-resistance; ~10MOhm off resistance due to leakage current.; MFR: Texas Instruments; MFR_PN: TMUX1247DCKR
U7 U18 U21 U24 = ad5272:AD5272BRMZ-XXX: high-precision i2c digital potentiometer pot / rheostat; MFR: Analog Devices; MFR_PN: AD5272BRMZ-100
U8 U25 = mcp3564:MCP3564; MFR: Microchip Technology; MFR_PN: MCP3564RT-E/ST
U12 U13 = txu0101qdckrq1:TXU0101QDCKRQ1; COPYRIGHT: Copyright (C) 2024 Ultra Librarian. All rights reserved.; MANUFACTURER_PART_NUMBER: TXU0101QDCKRQ1; MFR_NAME: Texas Instruments
U14 = SN74LVC2G14DCKR:SN74LVC2G14DCKR